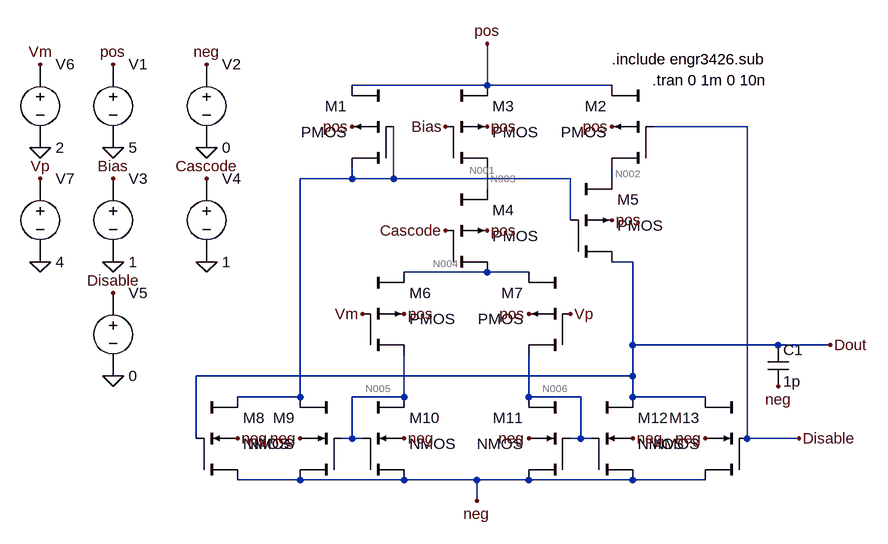
[diagram p0: schematic comparator_gainlatch.asc]
comparator_gainlatch.asc, the LTspice schematic file:
Version 4
SHEET 1 880 764
WIRE 240 48 240 -16
WIRE 240 48 32 48
WIRE 432 48 240 48
WIRE 640 112 496 112
WIRE 32 192 32 176
WIRE 32 192 -48 192
WIRE 96 192 96 112
WIRE 96 192 32 192
WIRE 368 192 96 192
WIRE 432 192 432 176
WIRE 240 208 240 176
WIRE 368 256 368 192
WIRE 464 320 432 320
WIRE 240 336 112 336
WIRE 304 336 240 336
WIRE 464 448 464 320
WIRE 688 448 464 448
WIRE 768 448 688 448
WIRE 464 496 464 448
WIRE 464 496 -208 496
WIRE -48 528 -48 192
WIRE -48 528 -144 528
WIRE 112 528 112 464
WIRE 112 528 32 528
WIRE 304 528 304 464
WIRE 384 528 304 528
WIRE 464 528 464 496
WIRE 576 528 464 528
WIRE -208 592 -208 496
WIRE 32 592 32 528
WIRE 32 592 16 592
WIRE 48 592 32 592
WIRE 384 592 384 528
WIRE 384 592 368 592
WIRE 400 592 384 592
WIRE 640 592 640 112
WIRE 720 592 640 592
WIRE -48 656 -144 656
WIRE 112 656 -48 656
WIRE 224 656 112 656
WIRE 304 656 224 656
WIRE 464 656 304 656
WIRE 576 656 464 656
WIRE 224 688 224 656
FLAG 32 112 pos
FLAG 240 112 pos
FLAG 432 112 pos
FLAG 240 272 pos
FLAG 432 256 pos
FLAG 112 400 pos
FLAG 304 400 pos
FLAG -48 592 neg
FLAG -144 592 neg
FLAG 112 592 neg
FLAG 304 592 neg
FLAG 464 592 neg
FLAG 576 592 neg
FLAG 688 512 neg
FLAG 368 400 Vp
FLAG 48 400 Vm
FLAG 224 688 neg
FLAG 720 592 Disable
FLAG 768 448 Dout
FLAG 240 -16 pos
FLAG -336 16 pos
FLAG -336 144 0
FLAG -192 16 neg
FLAG -192 144 0
FLAG 176 272 Cascode
FLAG 176 112 Bias
FLAG -336 320 0
FLAG -336 192 Bias
FLAG -192 320 0
FLAG -192 192 Cascode
FLAG -336 496 0
FLAG -336 368 Disable
FLAG -448 144 0
FLAG -448 320 0
FLAG -448 16 Vm
FLAG -448 192 Vp
SYMBOL cktsym\\pmos4 32 112 M0
SYMATTR InstName M1
SYMATTR Value2 l=.6u w=2u
SYMBOL cktsym\\pmos4 240 112 R0
SYMATTR InstName M3
SYMATTR Value2 l=4u w=16u
SYMBOL cktsym\\pmos4 432 112 M0
SYMATTR InstName M2
SYMATTR Value2 l=.6u w=2u
SYMBOL cktsym\\pmos4 240 272 R0
SYMATTR InstName M4
SYMATTR Value2 l=.8u w=3.2u
SYMBOL cktsym\\pmos4 432 256 R0
SYMATTR InstName M5
SYMATTR Value2 l=.6u w=2u
SYMBOL cktsym\\pmos4 112 400 R0
SYMATTR InstName M6
SYMATTR Value2 l=.8u w=1.6u
SYMBOL cktsym\\pmos4 304 400 M0
SYMATTR InstName M7
SYMATTR Value2 l=.8u w=1.6u
SYMBOL cktsym\\nmos4 -144 592 R0
SYMATTR InstName M8
SYMATTR Value2 l=.4u w=4u
SYMBOL cktsym\\nmos4 -48 592 M0
SYMATTR InstName M9
SYMATTR Value2 l=.6u w=1u
SYMBOL cktsym\\nmos4 112 592 R0
SYMATTR InstName M10
SYMATTR Value2 l=.6u w=1u
SYMBOL cktsym\\nmos4 304 592 M0
SYMATTR InstName M11
SYMATTR Value2 l=.6u w=1u
SYMBOL cktsym\\nmos4 464 592 R0
SYMATTR InstName M12
SYMATTR Value2 l=.6u w=1u
SYMBOL cktsym\\nmos4 576 592 M0
SYMATTR InstName M13
SYMATTR Value2 l=.4u w=1.4u
SYMBOL cap 672 448 R0
SYMATTR InstName C1
SYMATTR Value 1p
SYMBOL cktsym\\vsource -336 80 R0
WINDOW 123 0 0 Left 2
WINDOW 39 0 0 Left 2
SYMATTR Value 5
SYMATTR InstName V1
SYMBOL cktsym\\vsource -192 80 R0
WINDOW 123 0 0 Left 2
WINDOW 39 0 0 Left 2
SYMATTR Value 0
SYMATTR InstName V2
SYMBOL cktsym\\vsource -336 256 R0
WINDOW 123 0 0 Left 2
WINDOW 39 0 0 Left 2
SYMATTR Value 1
SYMATTR InstName V3
SYMBOL cktsym\\vsource -192 256 R0
WINDOW 123 0 0 Left 2
WINDOW 39 0 0 Left 2
SYMATTR Value 1
SYMATTR InstName V4
SYMBOL cktsym\\vsource -336 432 R0
WINDOW 123 0 0 Left 2
WINDOW 39 0 0 Left 2
SYMATTR Value 0
SYMATTR InstName V5
SYMBOL cktsym\\vsource -448 80 R0
WINDOW 123 0 0 Left 2
WINDOW 39 0 0 Left 2
SYMATTR Value 2
SYMATTR InstName V6
SYMBOL cktsym\\vsource -448 256 R0
WINDOW 123 0 0 Left 2
WINDOW 39 0 0 Left 2
SYMATTR Value 4
SYMATTR InstName V7
TEXT 432 8 Left 2 !.include engr3426.sub
TEXT 494 40 Left 2 !.tran 0 1m 0 10n

The netlist it stands for:
* comparator_gainlatch.asc
M1 N001 N001 pos pos PMOS l=.6u w=2u
M3 N003 Bias pos pos PMOS l=4u w=16u
M2 N002 Disable pos pos PMOS l=.6u w=2u
M4 N004 Cascode N003 pos PMOS l=.8u w=3.2u
M5 Dout N001 N002 pos PMOS l=.6u w=2u
M6 N005 Vm N004 pos PMOS l=.8u w=1.6u
M7 N006 Vp N004 pos PMOS l=.8u w=1.6u
M8 N001 Dout neg neg NMOS l=.4u w=4u
M9 N001 N005 neg neg NMOS l=.6u w=1u
M10 N005 N005 neg neg NMOS l=.6u w=1u
M11 N006 N006 neg neg NMOS l=.6u w=1u
M12 Dout N006 neg neg NMOS l=.6u w=1u
M13 Dout Disable neg neg NMOS l=.4u w=1.4u
C1 Dout neg 1p
V1 pos 0 5
V2 neg 0 0
V3 Bias 0 1
V4 Cascode 0 1
V5 Disable 0 0
V6 Vm 0 2
V7 Vp 0 4
.model NMOS NMOS
.model PMOS PMOS
.lib standard.mos
.include engr3426.sub
.tran 0 1m 0 10n
.backanno
.end

* Results of the author's LTspice run, read from the files saved beside the schematic
* Operating Point, zero values left out:
*   V(n001) = 120 mV
*   V(pos) = 5 V
*   V(n003) = 4.752 V
*   V(bias) = 1 V
*   V(n002) = 5 V
*   V(n004) = 4.491 V
*   V(cascode) = 1 V
*   V(dout) = 5 V
*   V(n005) = 1.718 V
*   V(vm) = 2 V
*   V(n006) = 266.2 mV
*   V(vp) = 4 V
*   Id(M13) = 7.737 pA
*   Ib(M13) = -7.638 pA
*   Id(M12) = 27.11 pA
*   Ib(M12) = -8.13 pA
*   Is(M12) = -18.98 pA
*   Id(M11) = 13.4 pA
*   Is(M11) = -13 pA
*   Id(M10) = 61.04 µA
*   Ib(M10) = -2.64 pA
*   Is(M10) = -61.04 µA
*   Id(M9) = 21.06 µA
*   Is(M9) = -21.06 µA
*   Id(M8) = 423.4 µA
*   Is(M8) = -423.4 µA
*   Id(M7) = -13.4 pA
*   Ib(M7) = 8.007 pA
*   Is(M7) = 5.396 pA
*   Id(M6) = -61.04 µA
*   Ib(M6) = 5.79 pA
*   Is(M6) = 61.04 µA
*   Id(M5) = -34.84 pA
*   Is(M5) = 34.84 pA
*   Id(M4) = -61.04 µA
*   Ib(M4) = 1.156 pA
*   Is(M4) = 61.04 µA
*   Id(M2) = -34.84 pA
*   Is(M2) = 34.84 pA
*   Id(M3) = -61.04 µA
*   Is(M3) = 61.04 µA
*   Id(M1) = -444.5 µA
*   Ib(M1) = 7.452 pA
*   Is(M1) = 444.5 µA
*   I(V2) = 505.5 µA
*   I(V1) = -505.5 µA